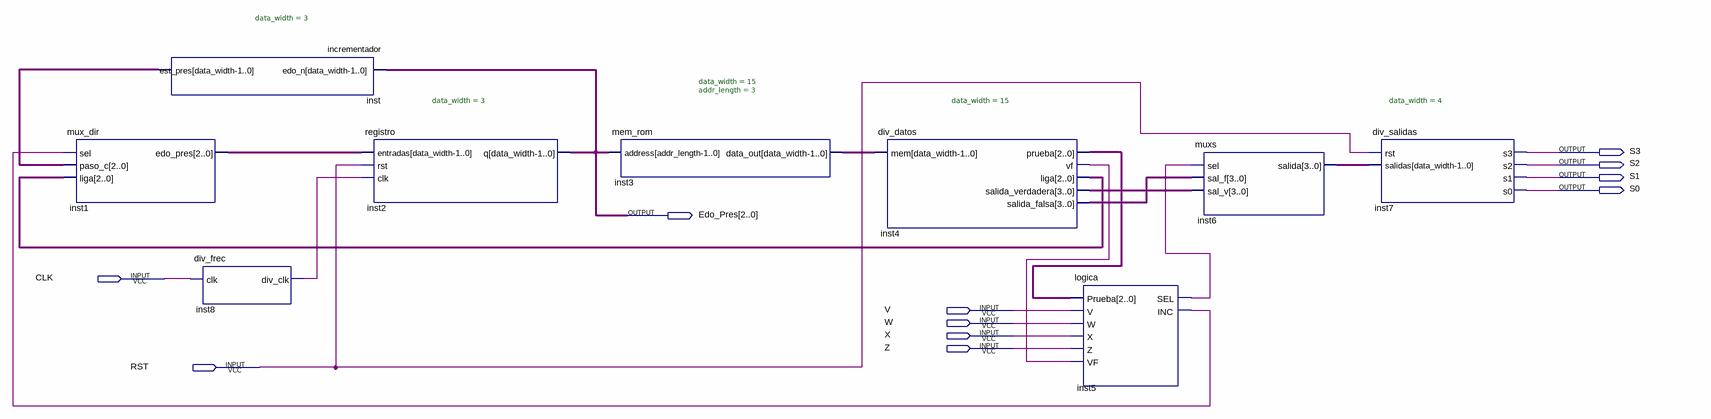
[diagram p0: schematic sheet]
// Quartus schematic Practica5.bdf as structural Verilog: 9 symbols, 11 pins
module Practica5 (
  input  CLK,
  input  V,
  input  W,
  input  X,
  input  Z,
  input  RST,
  output S3,
  output S2,
  output S1,
  output S0,
  output [2:0] Edo_Pres
);

  wire inst4_vf, inst5_inc, inst5_sel, inst8_div_clk;
  wire [2:0] inst1_edo_pres, inst4_liga, inst4_prueba, inst_est_pres;
  wire [3:0] inst4_salida_falsa, inst4_salida_verdadera, inst6_salida;
  wire [14:0] inst3_data_out;

  mux_dir inst1 (.sel(inst5_inc), .paso_c(inst_est_pres), .liga(inst4_liga), .edo_pres(inst1_edo_pres));
  incrementador #(.data_width(3)) inst (.edo_n(Edo_Pres), .est_pres(inst_est_pres));
  div_frec inst8 (.clk(CLK), .div_clk(inst8_div_clk));
  registro #(.data_width(3)) inst2 (.entradas(inst1_edo_pres), .rst(RST), .clk(inst8_div_clk), .q(Edo_Pres));
  mem_rom #(.data_width(15), .addr_length(3)) inst3 (.address(Edo_Pres), .data_out(inst3_data_out));
  div_datos #(.data_width(15)) inst4 (
    .mem(inst3_data_out), .prueba(inst4_prueba), .vf(inst4_vf), .liga(inst4_liga),
    .salida_verdadera(inst4_salida_verdadera), .salida_falsa(inst4_salida_falsa));
  logica inst5 (.Prueba(inst4_prueba), .V(V), .W(W), .X(X), .Z(Z), .VF(inst4_vf), .SEL(inst5_sel), .INC(inst5_inc));
  muxs inst6 (.sel(inst5_sel), .sal_f(inst4_salida_falsa), .sal_v(inst4_salida_verdadera), .salida(inst6_salida));
  div_salidas #(.data_width(4)) inst7 (.rst(RST), .salidas(inst6_salida), .s3(S3), .s2(S2), .s1(S1), .s0(S0));
endmodule
